# EAGLE schematic Artemis-Flex-Femto (EAGLE 9.5.1)
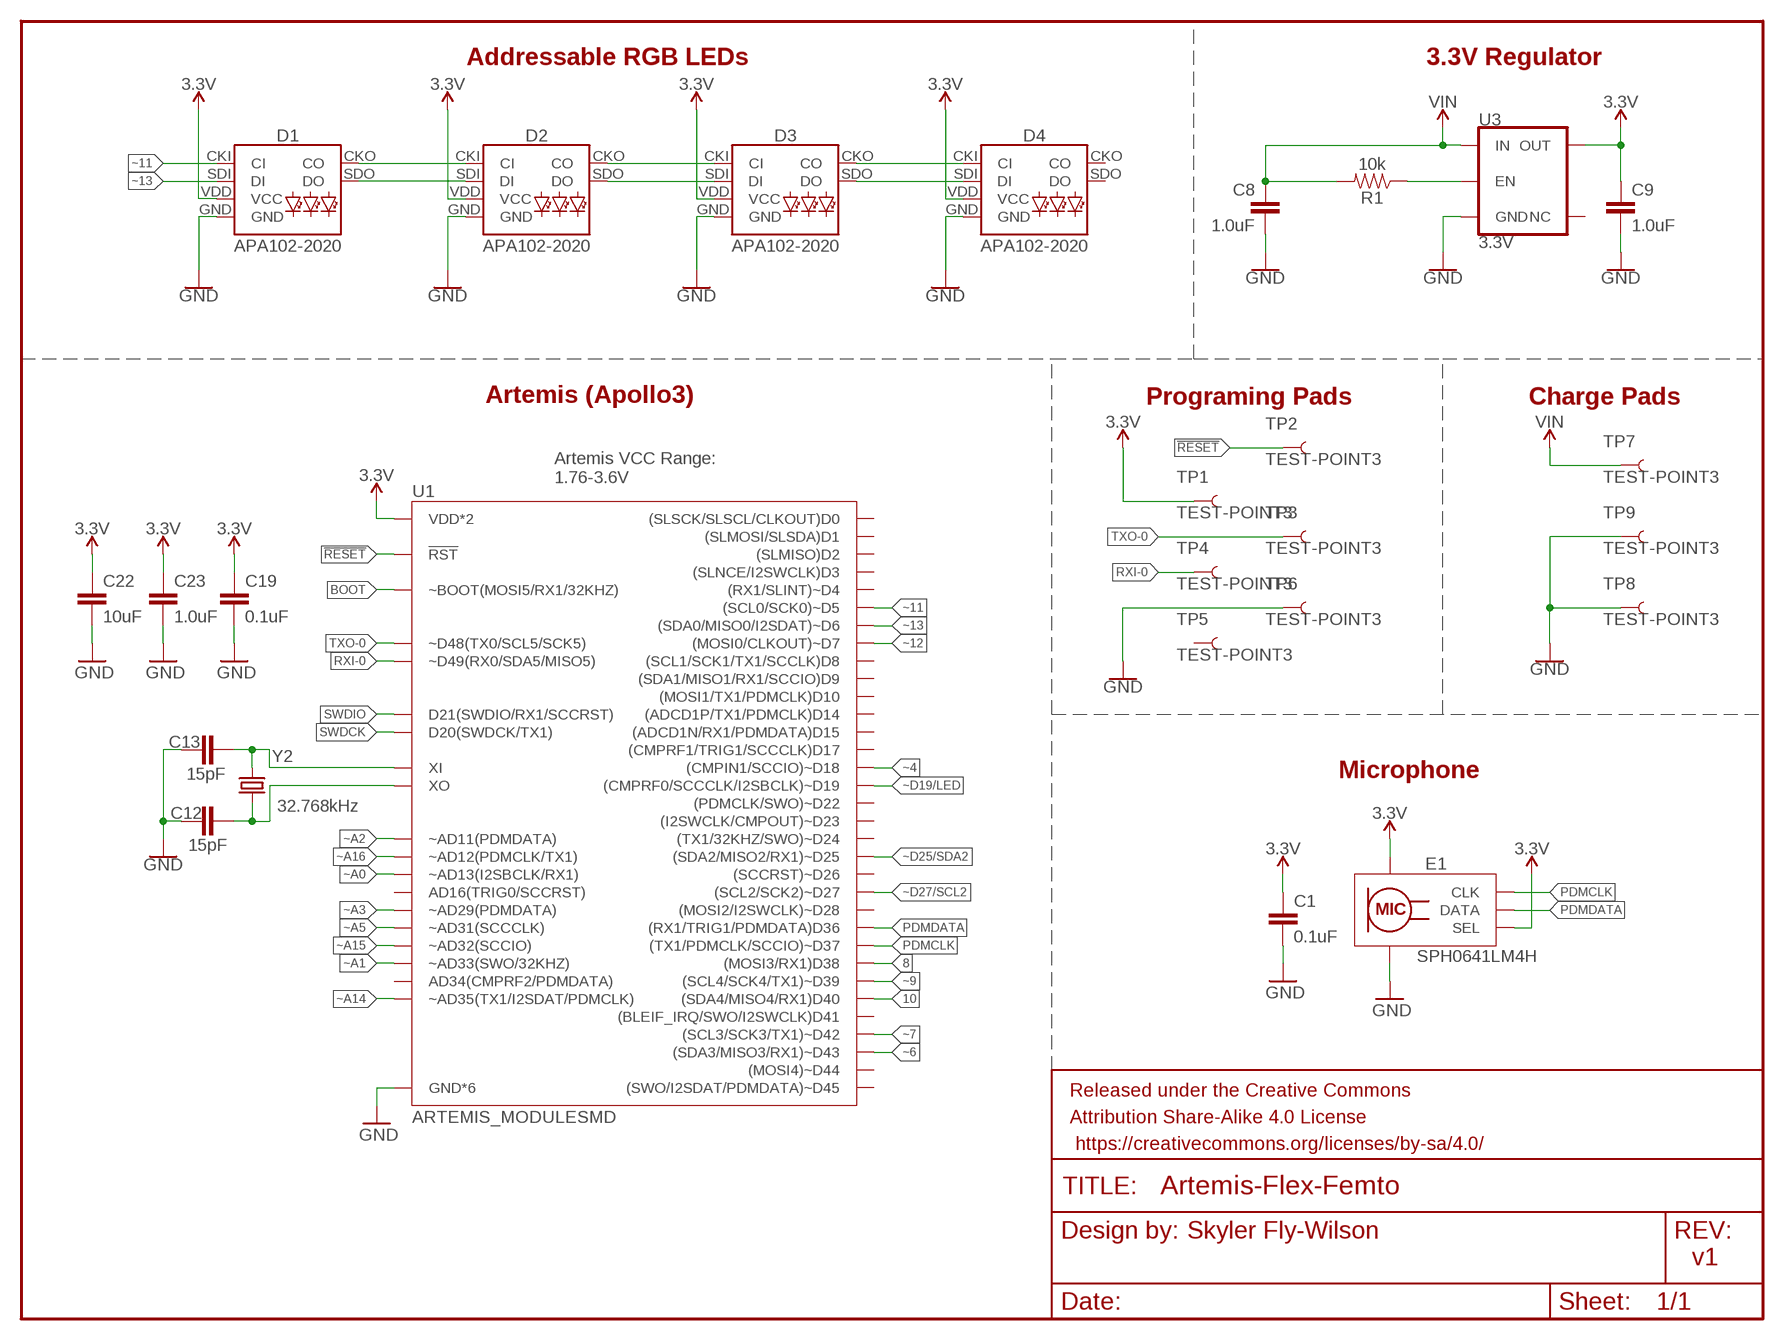
[diagram p0: schematic, sheet 1]

## Parts
C1  0.1uF  0.1UF-0402T-16V-10%  [0402-TIGHT]
C8  1.0uF  1.0UF-0402T-16V-10%  [0402-TIGHT]
C9  1.0uF  1.0UF-0402T-16V-10%  [0402-TIGHT]
C12  15pF  15PF-0603-50V-5%  [0603]
C13  15pF  15PF-0603-50V-5%  [0603]
C19  0.1uF  0.1UF-0402T-16V-10%  [0402-TIGHT]
C22  10uF  10UF-0603-6.3V-20%  [0603]
C23  1.0uF  1.0UF-0402T-16V-10%  [0402-TIGHT]
D1  APA102-2020  [APA102-2020]
D2  APA102-2020  [APA102-2020]
D3  APA102-2020  [APA102-2020]
D4  APA102-2020  [APA102-2020]
E1  SPH0641LM4H  SPH0641LM4H-1_MICROPHONE  [SPH0641LM4H-1_MICROPHONE]
FRAME1  FRAME-LETTER  [CREATIVE_COMMONS]
R1  10k  10KOHM-0603-1/10W-1%  [0603]
TP1  TEST-POINT3  [PAD.03X.03]
TP2  TEST-POINT3  [PAD.03X.03]
TP3  TEST-POINT3  [PAD.03X.03]
TP4  TEST-POINT3  [PAD.03X.03]
TP5  TEST-POINT3  [PAD.03X.03]
TP6  TEST-POINT3  [PAD.03X.03]
TP7  TEST-POINT3  [PAD.03X.03]
TP8  TEST-POINT3  [PAD.03X.03]
TP9  TEST-POINT3  [PAD.03X.03]
U1  ARTEMIS_MODULESMD  [ARTEMIS_FP]
U3  3.3V  V_REG_AP2112K-3.3V  [SOT23-5]
Y2  32.768kHz  CRYSTAL-32.768KHZSMD-3.2X1.5  [CRYSTAL-SMD-3.2X1.5MM]

## Nets
3.3V: C1.1 C9.1 C19.2 C22.1 C23.1 D1.VDD(VCC) D2.VDD(VCC) D3.VDD(VCC) D4.VDD(VCC) E1.2(SEL) E1.5(VDD) TP1.P$1 U1.VDD@36(VDD*2) U1.VDD@37(VDD*2) U3.5(OUT)
8: U1.D38((MOSI3/RX1)D38)
10: U1.D40((SDA4/MISO4/RX1)D40)
!RESET: U1.~RST(!RST)
BOOT: U1.BOOT(~BOOT(MOSI5/RX1/32KHZ))
GND: C1.2 C8.2 C9.2 C12.1 C13.1 C19.1 C22.2 C23.2 D1.GND D2.GND D3.GND D4.GND E1.3(GND) E1.6(GND) E1.7(GND) E1.8(GND) TP6.P$1 TP8.P$1 TP9.P$1 U1.GND@1(GND*6) U1.GND@22(GND*6) U1.GND@38(GND*6) U1.GND@39(GND*6) U1.GND@47(GND*6) U1.GND@59(GND*6) U3.2(GND)
N$1: R1.1 U3.3(EN)
N$2: C12.2 U1.XO Y2.P$2
N$3: D1.CKO(CO) D2.CKI(CI)
N$4: D1.SDO(DO) D2.SDI(DI)
N$5: D2.CKO(CO) D3.CKI(CI)
N$6: D2.SDO(DO) D3.SDI(DI)
N$7: D3.CKO(CO) D4.CKI(CI)
N$8: C13.2 U1.XI Y2.P$1
N$9: D3.SDO(DO) D4.SDI(DI)
N$10: D1.CKI(CI)
N$11: D1.SDI(DI)
N$12: TP2.P$1
N$13: TP3.P$1
N$14: TP4.P$1
PDMCLK: E1.4(CLK) U1.~D37((TX1/PDMCLK/SCCIO)~D37)
PDMDATA: E1.1(DATA) U1.D36((RX1/TRIG1/PDMDATA)D36)
RXI-0: U1.RXI-0(~D49(RX0/SDA5/MISO5))
SWDCK: U1.SWDCK(D20(SWDCK/TX1))
SWDIO: U1.SWDIO(D21(SWDIO/RX1/SCCRST))
TXO-0: U1.TXO-0(~D48(TX0/SCL5/SCK5))
VIN: C8.1 R1.2 TP7.P$1 U3.1(IN)
~4: U1.~D18((CMPIN1/SCCIO)~D18)
~6: U1.~D43((SDA3/MISO3/RX1)~D43)
~7: U1.~D42((SCL3/SCK3/TX1)~D42)
~9: U1.~D39((SCL4/SCK4/TX1)~D39)
~11: U1.~D5((SCL0/SCK0)~D5)
~12: U1.D7((MOSI0/CLKOUT)~D7)
~13: U1.~D6((SDA0/MISO0/I2SDAT)~D6)
~A0: U1.~AD13(~AD13(I2SBCLK/RX1))
~A1: U1.~AD33/SWO(~AD33(SWO/32KHZ))
~A2: U1.~AD11(~AD11(PDMDATA))
~A3: U1.~AD29(~AD29(PDMDATA))
~A5: U1.~AD31(~AD31(SCCCLK))
~A14: U1.~AD35(~AD35(TX1/I2SDAT/PDMCLK))
~A15: U1.~AD32(~AD32(SCCIO))
~A16: U1.~AD12(~AD12(PDMCLK/TX1))
~D19/LED: U1.~D19((CMPRF0/SCCCLK/I2SBCLK)~D19)
~D25/SDA2: U1.~D25((SDA2/MISO2/RX1)~D25)
~D27/SCL2: U1.~D27((SCL2/SCK2)~D27)
Unconnected: D4.CKO(CO) D4.SDO(DO) TP5.P$1 U1.AD16(AD16(TRIG0/SCCRST)) U1.AD34(AD34(CMPRF2/PDMDATA)) U1.D0((SLSCK/SLSCL/CLKOUT)D0) U1.D1((SLMOSI/SLSDA)D1) U1.D2((SLMISO)D2) U1.D3((SLNCE/I2SWCLK)D3) U1.D8((SCL1/SCK1/TX1/SCCLK)D8) U1.D9((SDA1/MISO1/RX1/SCCIO)D9) U1.D10((MOSI1/TX1/PDMCLK)D10) U1.D14((ADCD1P/TX1/PDMCLK)D14) U1.D15((ADCD1N/RX1/PDMDATA)D15) U1.D17((CMPRF1/TRIG1/SCCCLK)D17) U1.D41((BLEIF_IRQ/SWO/I2SWCLK)D41) U1.~D4((RX1/SLINT)~D4) U1.~D22((PDMCLK/SWO)~D22) U1.~D23((I2SWCLK/CMPOUT)~D23) U1.~D24((TX1/32KHZ/SWO)~D24) U1.~D26((SCCRST)~D26) U1.~D28((MOSI2/I2SWCLK)~D28) U1.~D44((MOSI4)~D44) U1.~D45((SWO/I2SDAT/PDMDATA)~D45) U3.4(NC)

## Notes on the sheet
- Addressable RGB LEDs | 3.3V Regulator
- Artemis (Apollo3) | Programing Pads | Charge Pads
- Artemis VCC Range:
  1.76-3.6V
- Microphone
- Skyler Fly-Wilson
- v1

## Library data of the parts
C1 C19 = SparkFun-Capacitors:0.1UF: 0.1µF ceramic capacitors A capacitor is a passive two-terminal electrical component used to store electrical energy temporarily in an electric field.; PROD_ID: CAP-12416
C8 C9 C23 = SparkFun-Capacitors:1.0UF: 1µF ceramic capacitors A capacitor is a passive two-terminal electrical component used to store electrical energy temporarily in an electric field.; PROD_ID: CAP-12417
C12 C13 = SparkFun-Capacitors:15PF: 15pF ceramic capacitors A capacitor is a passive two-terminal electrical component used to store electrical energy temporarily in an electric field.; PROD_ID: CAP-07881
C22 = SparkFun-Capacitors:10UF: 10.0µF ceramic capacitors A capacitor is a passive two-terminal electrical component used to store electrical energy temporarily in an electric field.; PROD_ID: CAP-11015
D1-D4 = SparkFun-LED:APA102: APA102 Addressable RGB LED Used in manufacturing of various products at SparkFun Packages: 5050 2020 SparkFun Products: SparkFun Lumenati Boards <https://www.sparkfun.com/categories/405>; PROD_ID: DIO-13883
E1 = SparkFun-Sensors:SPH0641LM4H-1_MICROPHONE: SPH0641LM4H-1 Microphone A miniature, high-performance, low power, bottom port silicon digital microphone with a single bit PDM output.; PROD_ID: IC-14361; VALUE: SPH0641LM4H-1
FRAME1 = SparkFun-Aesthetics:FRAME-LETTER: Schematic Frame - Letter Standard 8.5x11 US Letter frame
R1 = SparkFun-Resistors:10KOHM: 10kΩ resistor A resistor is a passive two-terminal electrical component that implements electrical resistance as a circuit element. Resistors act to reduce current flow, and, at the same time, act to lower voltage levels within circuits. - Wikipedia; PROD_ID: RES-00824
TP1-TP9 = SparkFun-Connectors:TEST-POINT: SparkFun Test Points Bare copper test points for troubleshooting or In-Circuit-Testing. These are used by our Production team for verifying production board runs using pogo-pins on test beds. SparkFun Products: SparkFun LSM9DS1 Breakout <https://www.sparkfun.com/products/13284> SparkFun PSOC <https://www.sparkfun.com/products/13714> SparkFun Load Cell Amplifier <https://www.sparkfun.com/products/13879>
U1 = SparkFun-IC-Microcontroller:ARTEMIS_MODULE: Description: The Artemis Module from SparkFun is a Cortex-M4F with BLE 5.0 running up to 96MHz and with as low power as 6uA per MHz (less than 5mW). This is the world's first module to bridge the market between hobbyists and consumer products. We've packaged all the power of a modern microcontroller into a module that is both extremely easy to use but is mass-market ready. The flexibility of the Artemis module starts with our [Arduino core](https://github.com/sparkfun/Arduino_Apollo3). You can program and use the Artemis module just like you would an Uno or any other Arduino. Time to first blink is just 5 minutes away! We built the core from the ground up, making it fast and as light weight as possible.; PROD_ID: SUB-14415
U3 = SparkFun-IC-Power:V_REG_AP2112: AP2112 - 600mA CMOS LDO Regulator w/ Enable The AP2112 is CMOS process low dropout linear regulator with enable function, the regulator delivers a guaranteed 600mA (min.) continuous load current. Features Output Voltage Accuracy: ±1.5% Output Current: 600mA (Min.) Foldback Short Current Protection: 50mA Enable Function to Turn ON/OFF VOUT Low Dropout Voltage (3.3V): 250mV (Typ.) @IOUT=600mA Excellent Load Regulation: 0.2%/A (Typ.) Excellent Line Regulation: 0.02%/V (Typ.) Low Quiescent Current: 55μA (Typ.) Low Standby Current: 0.01μA (Typ.) Low Output Noise: 50μVRMS PSRR: 100Hz -65dB, 1kHz -65dB OTSD Protection Stable with 1.0μF Flexible Cap: Ceramic, Tantalum and Aluminum Electrolytic Operation Temperature Range: -40°C to 85°C ESD: MM 400V, HBM 4000V; PROD_ID: VREG-12457
Y2 = SparkFun-Clocks:CRYSTAL-32.768KHZ: 32.768kHz Crystal Frequency: 32.768kHz Frequency Stability: ±20ppm Load Capacitance: 12.5pF (PTH-2X6 & SMD-3.2X1.5), 6pF (SMD-2X6) SparkFun Products: SparkFun BigTime Watch Kit <https://www.sparkfun.com/products/11734> SparkFun nRF52832 Breakout <https://www.sparkfun.com/products/13990> SparkFun Real Time Clock Module <https://www.sparkfun.com/products/12708>; PROD_ID: XTAL-13062

## Net classes
0 default: width 0 mm, drill 0 mm
1 power: width 0.762 mm
2 usb: width 0.254 mm, drill 0.305 mm, clearance 0.254 mm